# EAGLE schematic DronePoles (EAGLE 7.0.0)
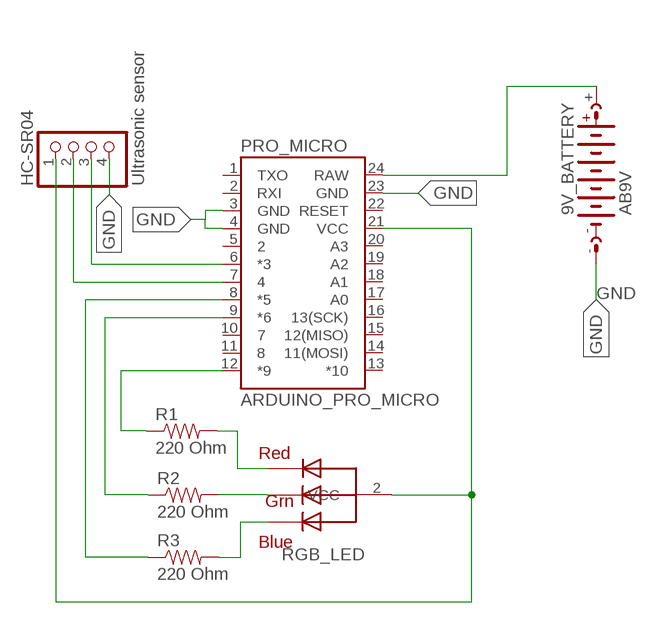
[diagram p0: schematic, sheet 1]

## Parts
9V_BATTERY  AB9V  [AB9V]
HC-SR04  Ultrasonic sensor  PINHD-1X4  [1X04]
PRO_MICRO  ARDUINO_PRO_MICRO  [ARDUINO_PRO_MICRO]
R1  220 Ohm  RESISTORAXIAL-0.3  [AXIAL-0.3]
R2  220 Ohm  RESISTORAXIAL-0.3  [AXIAL-0.3]
R3  220 Ohm  RESISTORAXIAL-0.3  [AXIAL-0.3]
RGB_LED  RGBLED_CA  [LED5MMRGB]

## Nets
ECHO: HC-SR04.3 PRO_MICRO.6(*3)
GND: 9V_BATTERY.- HC-SR04.4 PRO_MICRO.3(GND) PRO_MICRO.4(GND) PRO_MICRO.23(GND)
N$1: R3.P$2 RGB_LED.4(BLUE)
N$2: R2.P$2 RGB_LED.3(GREEN)
N$3: R1.P$2 RGB_LED.1(RED)
N$4: 9V_BATTERY.+ PRO_MICRO.24(RAW)
N$5: PRO_MICRO.9(*6) R2.P$1
N$7: PRO_MICRO.12(*9) R1.P$1
N$9: PRO_MICRO.8(*5) R3.P$1
TRIG: HC-SR04.2 PRO_MICRO.7
VCC: HC-SR04.1 PRO_MICRO.21(VCC) RGB_LED.2(VCC)
Unconnected: PRO_MICRO.1(TXO) PRO_MICRO.2(RXI) PRO_MICRO.5 PRO_MICRO.10 PRO_MICRO.11 PRO_MICRO.13(*10) PRO_MICRO.14(11(MOSI)) PRO_MICRO.15(12(MISO)) PRO_MICRO.16(13(SCK)) PRO_MICRO.17(A0) PRO_MICRO.18(A1) PRO_MICRO.19(A2) PRO_MICRO.20(A3) PRO_MICRO.22(RESET)

## Library data of the parts
9V_BATTERY = battery:AB9V: 9-V BATTERY CLIP
HC-SR04 = pinhead:PINHD-1X4: PIN HEADER
PRO_MICRO = SparkFun-Boards:ARDUINO_PRO_MICRO
R1-R3 = SparkFun-Passives:RESISTOR: Resistor Basic schematic elements and footprints for 0603, 1206, and PTH resistors.
RGB_LED = adafruit:RGBLED_CA: RGB LED, common-anode Staggered pins http://www.ladyada.net/library/pcb/eaglelibrary.html